# Altium project EDR_Keypad.PrjPcb
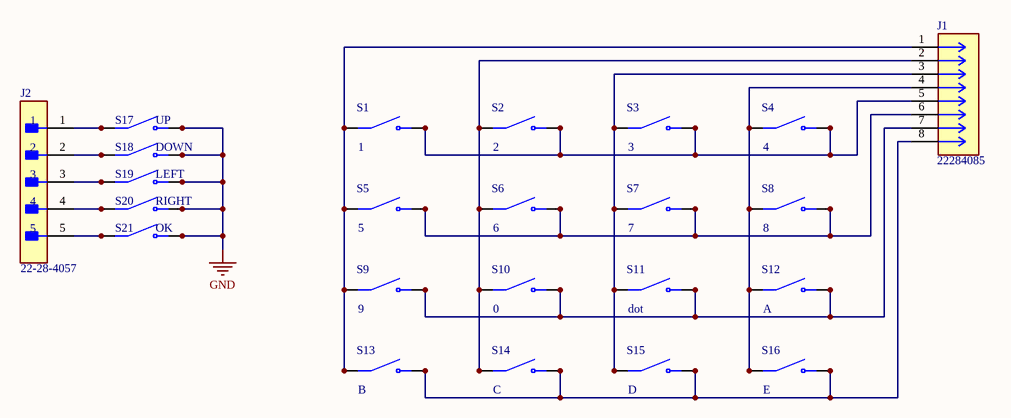
[diagram p0: keypad.SchDoc]
1 sheet, 23 parts. Net scope: global (net labels, ports and power ports of the same name join across sheets).
Board file: keypad.PcbDoc

## Sheet keypad.SchDoc
size A; SheetNumber: 1; SheetTotal: 1

### Parts
J1  22284085  [CONN_SD-42375-001_M295_08_MOL]
J2  22-28-4057  [FP-22-28-4057-MFG]
S1  1  [SW_B3F-4050]
S2  2  [SW_B3F-4050]
S3  3  [SW_B3F-4050]
S4  4  [SW_B3F-4050]
S5  5  [SW_B3F-4050]
S6  6  [SW_B3F-4050]
S7  7  [SW_B3F-4050]
S8  8  [SW_B3F-4050]
S9  9  [SW_B3F-4050]
S10  0  [SW_B3F-4050]
S11  dot  [SW_B3F-4050]
S12  A  [SW_B3F-4050]
S13  B  [SW_B3F-4050]
S14  C  [SW_B3F-4050]
S15  D  [SW_B3F-4050]
S16  E  [SW_B3F-4050]
S17  UP  [SW_B3F-4050]
S18  DOWN  [SW_B3F-4050]
S19  LEFT  [SW_B3F-4050]
S20  RIGHT  [SW_B3F-4050]
S21  OK  [SW_B3F-4050]

### Nets
GND: S17.3(NO) S17.4(NO) S18.3(NO) S18.4(NO) S19.3(NO) S19.4(NO) S20.3(NO) S20.4(NO) S21.3(NO) S21.4(NO)
NetJ1_1: J1.1 S1.1(COM) S1.2(COM) S5.1(COM) S5.2(COM) S9.1(COM) S9.2(COM) S13.1(COM) S13.2(COM)
NetJ1_2: J1.2 S2.1(COM) S2.2(COM) S6.1(COM) S6.2(COM) S10.1(COM) S10.2(COM) S14.1(COM) S14.2(COM)
NetJ1_3: J1.3 S3.1(COM) S3.2(COM) S7.1(COM) S7.2(COM) S11.1(COM) S11.2(COM) S15.1(COM) S15.2(COM)
NetJ1_4: J1.4 S4.1(COM) S4.2(COM) S8.1(COM) S8.2(COM) S12.1(COM) S12.2(COM) S16.1(COM) S16.2(COM)
NetJ1_5: J1.5 S1.3(NO) S1.4(NO) S2.3(NO) S2.4(NO) S3.3(NO) S3.4(NO) S4.3(NO) S4.4(NO)
NetJ1_6: J1.6 S5.3(NO) S5.4(NO) S6.3(NO) S6.4(NO) S7.3(NO) S7.4(NO) S8.3(NO) S8.4(NO)
NetJ1_7: J1.7 S9.3(NO) S9.4(NO) S10.3(NO) S10.4(NO) S11.3(NO) S11.4(NO) S12.3(NO) S12.4(NO)
NetJ1_8: J1.8 S13.3(NO) S13.4(NO) S14.3(NO) S14.4(NO) S15.3(NO) S15.4(NO) S16.3(NO) S16.4(NO)
NetJ2_1: J2.1 S17.1(COM) S17.2(COM)
NetJ2_2: J2.2 S18.1(COM) S18.2(COM)
NetJ2_3: J2.3 S19.1(COM) S19.2(COM)
NetJ2_4: J2.4 S20.1(COM) S20.2(COM)
NetJ2_5: J2.5 S21.1(COM) S21.2(COM)

### Library data of the parts
J1 = CMP-007-000000-1: Component Type: Standard; Value: *; MP: 22284085; Availability: Unavailable; Source: 22284085.SchLib; Design Item ID: 22284085; Package: None; Price: None; Pin Count: 8
J2 = CMP-04776-001007-1: KK 100 HDR ASSY BKWY 05 CKT 30 S; Connector Type: Male Pin; Number of Contacts: 5; Glow Wire Compliant: Non-compliant; Gender: Male; Max Voltage Rating (DC): 250.25kV; Pitch: 2.54mm; Current Rating: 4A; Voltage Rating: 250V; Contact Resistance: 20mR; Min Operating Temperature: 0°C; Mount: Through Hole; Lead Free: Lead Free; Housing Color: Black; Max Operating Temperature: 75°C; Color: Black; Number of Rows: 1; Number of Circuits: 5; Contact Material: Brass; Packaging: Bulk; Contact Plating: Gold; Package Quantity: 1; Orientation: Straight; RoHS Compliant: Yes; Contact Type: Male Pin; Termination: Solder; Contact Mating Length: 0.32inch; Series: 42375; Number of Positions: 5; Housing Material: Thermoplastic
S1-S21 = CMP-011-00013-1: Tactile Switch SPST-NO Top Actuated Through Hole; MF: Omron Electronics; Case/Package: None; MP: B3F-4050; Source: B3F-4050.SchLib; SnapEDA_Link: https://www.snapeda.com/parts/B3F-4050/Omron%20Electronics%20Inc-EMC%20Div/view-part/274265/?ref=snap; Value: *; Component Type: Standard; Design Item ID: B3F-4050; Pins: 4; Price: None; Availability: Unavailable